# Altium schematic sheet Sheet1.SchDoc
size B
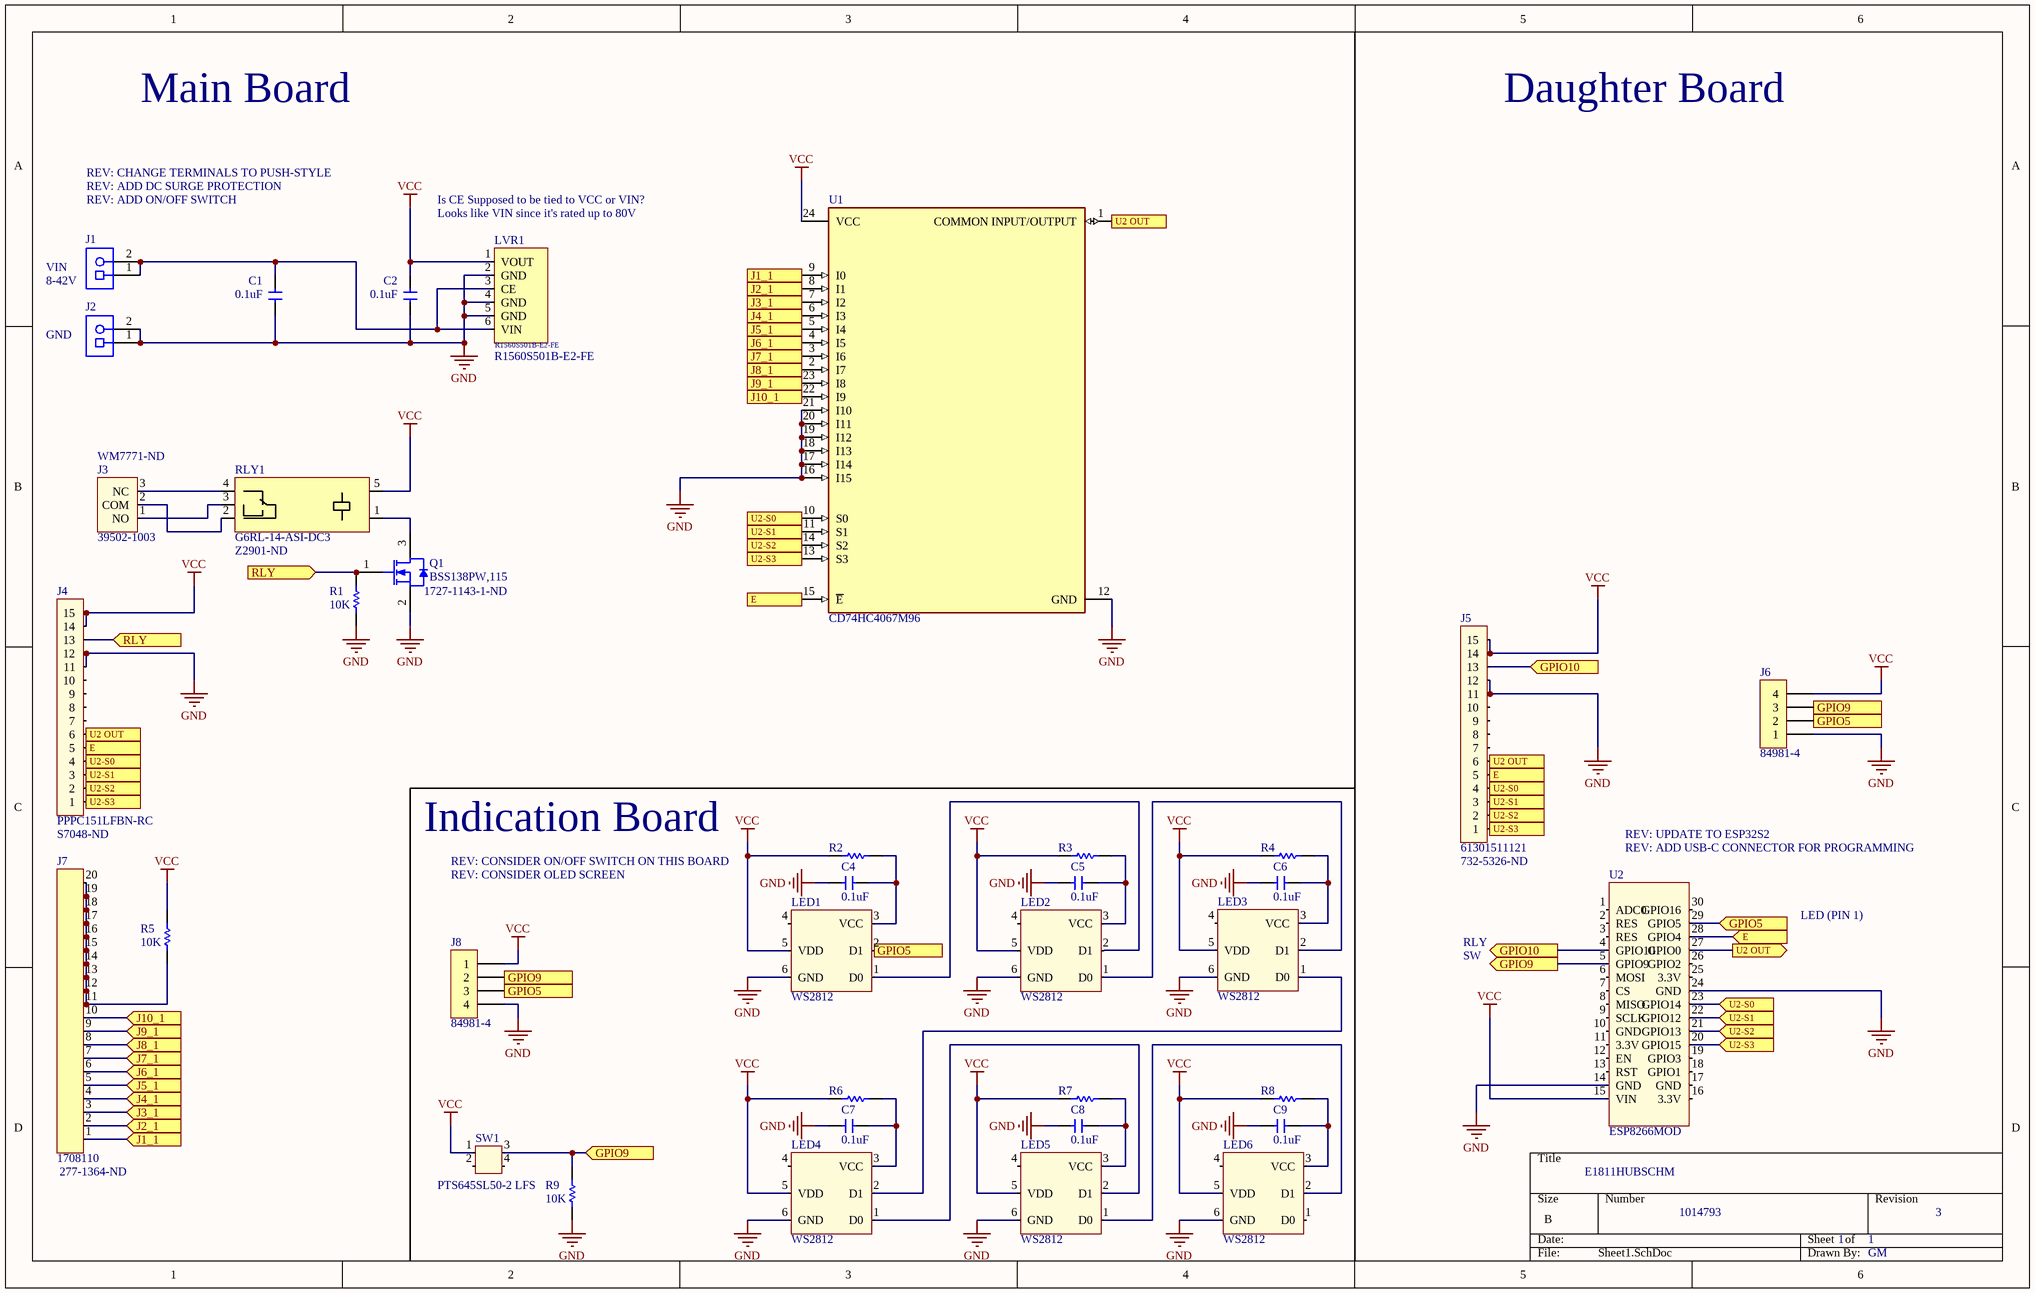
[diagram p0: Sheet1.SchDoc]

## Parts
C1  0.1uF  [CAPC2012N]
C2  0.1uF  [CAPC2012N]
C4  0.1uF  [CAPC2012N]
C5  0.1uF  [CAPC2012N]
C6  0.1uF  [CAPC2012N]
C7  0.1uF  [CAPC2012N]
C8  0.1uF  [CAPC2012N]
C9  0.1uF  [CAPC2012N]
J1  1729128  [PHOE-1729128-2_V]  (value not drawn)
J2  1729128  [PHOE-1729128-2_V]  (value not drawn)
J3  39502-1003  Supplier Part Number 1: WM7771-ND  [39502-1003]
J4  PPPC151LFBN-RC  Supplier Part Number 1: S7048-ND  [PPPC151LFBN-RC]
J5  61301511121  Supplier Part Number 1: 732-5326-ND  [61301511121]
J6  84981-4  [84981-4]
J7  1708110  Supplier Part Number 1: 277-1364-ND  [1708110]
J8  84981-4  [84981-4]
LED1  WS2812  [WS2812]
LED2  WS2812  [WS2812]
LED3  WS2812  [WS2812]
LED4  WS2812  [WS2812]
LED5  WS2812  [WS2812]
LED6  WS2812  [WS2812]
LVR1  R1560S501B-E2-FE  [HSOP-6J]
Q1  BSS138PW,115  Supplier Part Number 1: 1727-1143-1-ND  [NXP-SOT323_M]
R1  10K  [RESC2012N]
R2  150  [RESC2012N]  (value not drawn)
R3  150  [RESC2012N]  (value not drawn)
R4  150  [RESC2012N]  (value not drawn)
R5  10K  [RESC2012N]
R6  150  [RESC2012N]  (value not drawn)
R7  150  [RESC2012N]  (value not drawn)
R8  150  [RESC2012N]  (value not drawn)
R9  10K  [RESC2012N]
RLY1  G6RL-14-ASI-DC3  Supplier Part Number 1: Z2901-ND  [G6RL-14-ASI-DC3]
SW1  PTS645SL50-2 LFS  [PTS645SL50-2 LFS]
U1  CD74HC4067M96  [FP-DW0024A-MFG]
U2  ESP8266MOD  [ESP8266NODEMCU]

## Ports
E (in), GPIO5 (in), GPIO9 (in), GPIO9 (out), GPIO10 (in), GPIO10 (out), J1_1 (in), J2_1 (in), J3_1 (in), J4_1 (in), J5_1 (in), J6_1 (in), J7_1 (in), J8_1 (in), J9_1 (in), J10_1 (in), RLY (in), U2 OUT (out), U2-S0 (in), U2-S1 (in), U2-S2 (in), U2-S3 (in)

## Nets
GND: C1.1 C2.1 C4.1 C5.1 C6.1 C7.1 C8.1 C9.1 J2.1 J2.2 J4.11 J4.12 J5.11 J5.12 J6.1 J8.4 LED1.6(GND) LED2.6(GND) LED3.6(GND) LED4.6(GND) LED5.6(GND) LED6.6(GND) LVR1.2(GND) LVR1.4(GND) LVR1.5(GND) Q1.2(S) R1.1 R9.1 U1.12(GND) U1.16(I15) U1.17(I14) U1.18(I13) U1.19(I12) U1.20(I11) U1.21(I10) U2.14(GND) U2.24(GND)
VCC: C2.2 J4.14 J4.15 J5.14 J5.15 J6.4 J8.1 LED1.5(VDD) LED2.5(VDD) LED3.5(VDD) LED4.5(VDD) LED5.5(VDD) LED6.5(VDD) LVR1.1(VOUT) R2.1 R3.1 R4.1 R5.2 R6.1 R7.1 R8.1 RLY1.5 SW1.1 U1.24(VCC) U2.15(VIN)
E: J4.5 J5.5 U1.15(~{E}) U2.28(GPIO4) ; port E
GPIO5: J6.2 J8.3 LED1.2(D1) U2.29(GPIO5) ; port GPIO5
GPIO9: J6.3 J8.2 R9.2 SW1.3 U2.5(GPIO9) ; port GPIO9
GPIO10: J5.13 U2.4(GPIO10) ; port GPIO10
J1_1: J7.1 U1.9(I0) ; port J1_1
J2_1: J7.2 U1.8(I1) ; port J2_1
J3_1: J7.3 U1.7(I2) ; port J3_1
J4_1: J7.4 U1.6(I3) ; port J4_1
J5_1: J7.5 U1.5(I4) ; port J5_1
J6_1: J7.6 U1.4(I5) ; port J6_1
J7_1: J7.7 U1.3(I6) ; port J7_1
J8_1: J7.8 U1.2(I7) ; port J8_1
J9_1: J7.9 U1.23(I8) ; port J9_1
J10_1: J7.10 U1.22(I9) ; port J10_1
RLY: J4.13 Q1.1(G) R1.2 ; port RLY
U2 OUT: J4.6 J5.6 U1.1(COMMON_INPUT/OUTPUT) U2.27(GPIO0) ; port U2 OUT
U2-S0: J4.4 J5.4 U1.10(S0) U2.23(GPIO14) ; port U2-S0
U2-S1: J4.3 J5.3 U1.11(S1) U2.22(GPIO12) ; port U2-S1
U2-S2: J4.2 J5.2 U1.14(S2) U2.21(GPIO13) ; port U2-S2
U2-S3: J4.1 J5.1 U1.13(S3) U2.20(GPIO15) ; port U2-S3
NetC1_2: C1.2 J1.1 J1.2 LVR1.3(CE) LVR1.6(VIN)
NetC4_2: C4.2 LED1.3(VCC) R2.2
NetC5_2: C5.2 LED2.3(VCC) R3.2
NetC6_2: C6.2 LED3.3(VCC) R4.2
NetC7_2: C7.2 LED4.3(VCC) R6.2
NetC8_2: C8.2 LED5.3(VCC) R7.2
NetC9_2: C9.2 LED6.3(VCC) R8.2
NetJ3_1: J3.1(NO) RLY1.3
NetJ3_2: J3.2(COM) RLY1.2
NetJ3_3: J3.3(NC) RLY1.4
NetJ7_11: J7.11 J7.12 J7.13 J7.14 J7.15 J7.16 J7.17 J7.18 J7.19 J7.20 R5.1
NetLED1_1: LED1.1(D0) LED2.2(D1)
NetLED2_1: LED2.1(D0) LED3.2(D1)
NetLED3_1: LED3.1(D0) LED4.2(D1)
NetLED4_1: LED4.1(D0) LED5.2(D1)
NetLED5_1: LED5.1(D0) LED6.2(D1)
NetQ1_3: Q1.3(D) RLY1.1

Not connected (* = marked no-connect by the designer): J4 7 8 9 10; J5 7 8 9 10; LED1 4(_); LED2 4(_); LED3 4(_); LED4 4(_); LED5 4(_); LED6 1(D0) 4(_); SW1 2 4; U2 1(ADC0) 2(RES) 3(RES) 6(MOSI) 7(CS) 8(MISO) 9(SCLK) 10(GND) 11(3.3V) 12(EN) 13(RST) 16(3.3V) 17(GND) 18(GPIO1) 19(GPIO3) 25(3.3V) 26(GPIO2) 30(GPIO16)

## Notes on the sheet
- Main Board
- Daughter Board
- REV: CHANGE TERMINALS TO PUSH-STYLE
- REV: ADD DC SURGE PROTECTION
- REV: ADD ON/OFF SWITCH
- Is CE Supposed to be tied to VCC or VIN?
- (near LVR1) Looks like VIN since it's rated up to 80V
- VIN
- 8-42V
- GND
- Indication Board
- REV: UPDATE TO ESP32S2
- REV: CONSIDER ON/OFF SWITCH ON THIS BOARD
- REV: CONSIDER OLED SCREEN
- REV: ADD USB-C CONNECTOR FOR PROGRAMMING
- RLY
- SW
- LED (PIN 1)
- E1811HUBSCHM
- 1014793
- 1
- 3
- GM

## Library data of the parts
C1 C2 C4-C9 = Cap_0.1uF_50V_0805: CAP CER 0.1UF 50V; Manufacturer: KEMET; Manufacturer P/N: C0805C104M5RACAUTO; Dielectric Material: Ceramic; Tolerance: 20%; Dielectric: X7R; Capacitance: 100nF; Supplier 1: Digi-Key; Supplier Part Number 1: 399-12977-1-ND; Mount: Surface Mount; Case/Package: 0805; Case Code (Metric): 2012; Case Code (Imperial): 0805; Contact Plating: Matte,Tin; Min Operating Temperature: -55°C; Max Operating Temperature: 125°C; Voltage Rating: 50V; Voltage Rating (DC): 50V; Termination: Wraparound; Length: 2mm; Width: 0.049inch; Thickness: 0.035inch; Depth: 1.25mm; Ratings: AEC-Q200; REACH SVHC: No SVHC
J1 J2 = CMP-2000-05815-1: PCB Terminal Block, 13.5 A, 400 V, 2-Pin THD, RoHS, Bulk; Manufacturer: Phoenix Contact; Package Version: 03/2015; No. of Rows: 1; Pitch: 5.08mm; No. of Positions: 2; Voltage Rating: 400V; Current Rating: 13500mA; Connector Type: Screw; Current: 10A; Voltage: 300V; Max Current Rating: 13.5A; Test Voltage: 4kV; Wire Gauge (Max): 26AWG; Wire Gauge (Min): 14AWG; Approvals: UL,CSA; Manufacturer URL: http://www.phoenixcontact.com/; Datasheet URL: https://datasheet.ciiva.com/16046/1729128-16046181.pdf; RoHS: TRUE; Package URL: https://www.phoenixcontact.com/online/portal/pi/pxc/product_detail_page/!ut/p/b1/3VdJjqNKFDxLH8AFycySyWY2ozFsEPOMMQaDOX1XedGL_1Vdm5YXJleknhSKeBkvI6EA8ncAo3AYoDhBQGco6KN7VURTdemj9us_IEKEZo_YHiPAEWEFmDGOHMORkqKYCORBZxgL7ZoaZYcbFFUZ3fqxSY6GOuxydWUuHqz1ynmMFygu583Bob0Ewr6Sd_l-5m-kAueHiB0jpRwZwe58wwtkpxtMYd_LmGcDRU02dRNEyWt6Y2ti5pSyJ_reIkzIulrqApdnbT11V5jnCKbYNCvhEM1MCpPByat_X379-iThf08CI5GfOPqfBeS3BRoBOdD55AKVv0iLwCMq-2BrzXWSGRH7pUGD9uwXQjiph3xL0DKQwdGa0JImiIOmBNOestqgwTHSSs2oOep-78apyXQBvNi8ZLaFjvjWvcaUEBu0MC6Wbe-d6mB0FAebo2lUWinqYaZs5DAYzV0RP9yitUjnGJ0iI9xhZkT42OCQNUJJhkgWINNQLP2JFP6OpMg3JCVg70jqHT0lvKOnhHf0lPuOnnLf0VPuWx6_dxwUIvwk5WMkT0kLL1mh61l2yZVSzG3pYV_bqo-mj6uMKwKwdnnW8Jh5RTOJzMOA5c-eJDaZQw4mTMPH02PvS_ZAqNVjVTo2WyYLkwH_KU1mmmG5kjRhDqPXLwwVHvVOjCM60-fpXvTDfMGW1PVFVS1r4e4yVDk4ZdNbkUHvqPqQSeian4UD39fNKmachqdJ1NJbyk8rXT9mXTvPk3oE5meulKGgiruPJek-4I9hTT6G8ZLOyRSm2RRVbThERQad5OS28hdt4YW4vG0stgYYzsWsK4_7y6DZMjJSCqri1kyiZR5vD7pwIrNR7QwPHTcLTI5qT7eRlpHrdGiupYlqQDJ7zy_CND8fWWBoLRXxk1RVcXiBQwbTD4Xi7KL-FuO94t9xaqweXzH; PartNumber: 1729128; Package Description: 2-Pin Through Hole Device, Body 8.1 x 10.16 mm, Pitch 5.08 mm; Datasheet Version: 12/2013; Mounting Technology: ThroughHole; Orientation: Horizontal; Package Reference: 1729128-2; Packing: Bulk; Supplier 1: Digi-Key; Manufacturer Part Number: 1729128; Category: Terminal Blocks; Stock 1: 30124; Pricing 1: 1=1.09000, 10=1.04700, 50=1.00100, 100=0.97370, 250=0.91000, 500=0.83720, 1000=0.77350, 2500=0.73710, 5000=0.69160 (USD); Mount: Through Hole; Number of Pins: 2; Color: Green; Housing Color: Green; Housing Material: Polyamide; Contact Material: Tin; Weight: 0.069842oz; Insulation Material: Nylon; Min Operating Temperature: -20°C; Max Operating Temperature: 100°C; Packaging: Bulk; Termination: Solder; Number of Positions: 2; Number of Poles: 2; Package Quantity: 50; Number of Contacts: 2; Series: MKDSN; Number of Rows: 1; Number of Levels: 1; Number of Positions Per Level: 2; Max Supply Voltage: 400V; Number of Circuits: 2; Length: 8.1mm; Width: 13.5mm; Height: 13.5mm; Depth: 8.1mm; Wire/Cable Gauge: 26AWG; Radiation Hardening: No; REACH SVHC: No SVHC; Flammability Rating: UL94 V-0; RoHS Compliant: Yes; Lead Free: Lead Free; ComponentLink1URL: https://datasheet.ciiva.com/823/1729128-823779.pdf?src-supplier=Digi-Key; ComponentLink1Description: https://datasheet.ciiva.com/823/1729128-823779.pdf?src-supplier=Digi-Key; ComponentLink2URL: https://datasheet.ciiva.com/15169/getdatasheetpartid-199310-15169845.pdf?src-supplier=Verical; ComponentLink2Description: https://datasheet.ciiva.com/15169/getdatasheetpartid-199310-15169845.pdf?src-supplier=Verical; ComponentLink3URL: https://datasheet.ciiva.com/16046/1729128-16046181.pdf?src-supplier=Onlinecomponents.com; ComponentLink3Description: https://datasheet.ciiva.com/16046/1729128-16046181.pdf?src-supplier=Onlinecomponents.com; ComponentLink4URL: https://datasheet.ciiva.com/14607/70054405-14607157.pdf?src-supplier=Allied+Electronics; ComponentLink4Description: https://datasheet.ciiva.com/14607/70054405-14607157.pdf?src-supplier=Allied+Electronics; ComponentLink5URL: https://datasheet.ciiva.com/29218/743664-da-01-en-printklemmenblock-mkdsn-1-5-2-5-08-29218154.pdf?src-supplier=Conrad; ComponentLink5Description: https://datasheet.ciiva.com/29218/743664-da-01-en-printklemmenblock-mkdsn-1-5-2-5-08-29218154.pdf?src-supplier=Conrad
  J2: Supplier Part Number 1: 277-1247-ND
J3 = 39502-1003: TERM BLOCK HDR 3POS 90DEG 3.5MM; Manufacturer: Molex; Manufacturer Part Number: 0395021003; Contact Resistance: 8mR; Current Rating: 8A; Voltage Rating: 300V; Number of Positions: 3; Number of Levels: 1; Supplier 1: Digi-Key; RoHS: Yes; Category: Headers and Wire Housings; Stock 1: 1366; Pricing 1: 1=0.78000, 10=0.64800, 100=0.54000, 1000=0.43200, 5000=0.37800, 10000=0.35910 (USD); Mount: Through Hole; Contact Plating: Tin; Color: Black; Housing Color: Black; Contact Material: Brass; Housing Material: Polyamide; Min Operating Temperature: -40°C; Max Operating Temperature: 105°C; Number of Rows: 1; Package Quantity: 1280; Packaging: Bulk; Termination: Solder; Number of Contacts: 3; Orientation: Right Angle; Number of Circuits: 3; Series: Eurostyle™ ESE 39502; Number of Positions Per Level: 3; Current: 8A; Voltage: 300V; Length: 11.89mm; Width: 9.2mm; Pitch: 3.5mm; Depth: 9.2mm; REACH SVHC: No SVHC; Halogen Free: Low Halogen; ELV: Compliant; Lead Free: Lead Free; Flammability Rating: UL94 V-0; RoHS Compliant: Yes; ComponentLink1URL: http://www.onlinecomponents.com/datasheet/395021003.aspx?p=17943918&src-supplier=Onlinecomponents.com; ComponentLink1Description: http://www.onlinecomponents.com/datasheet/395021003.aspx?p=17943918&src-supplier=Onlinecomponents.com; ComponentLink2URL: http://components.arrow.com/part/dataview/0323_01936340?src-supplier=Arrow+Europe; ComponentLink2Description: http://components.arrow.com/part/dataview/0323_01936340?src-supplier=Arrow+Europe; ComponentLink3URL: http://www.molex.com/webdocs/datasheets/pdf/en-us/0395021003_TERMINAL_BLOCKS.pdf?src-supplier=Avnet; ComponentLink3Description: http://www.molex.com/webdocs/datasheets/pdf/en-us/0395021003_TERMINAL_BLOCKS.pdf?src-supplier=Avnet; ComponentLink4URL: https://www.molex.com/pdm_docs/sd/395021002_sd.pdf?src-supplier=Digi-Key; ComponentLink4Description: https://www.molex.com/pdm_docs/sd/395021002_sd.pdf?src-supplier=Digi-Key; ComponentLink5URL: http://components.arrow.com/part/dataview/44158187S8420486N3303?src-supplier=Arrow+Electronics; ComponentLink5Description: http://components.arrow.com/part/dataview/44158187S8420486N3303?src-supplier=Arrow+Electronics
J4 = PPPC151LFBN-RC: CONN HEADER FMALE 15POS .1" GOLD; Manufacturer: Sullins; Number of Positions: 15; Pitch: 0.1inch; Supplier 1: Digi-Key; Manufacturer Part Number: PPPC151LFBN-RC; RoHS: Yes; Category: Connectors; Stock 1: 4250; Pricing 1: 1=1.02000, 10=0.89300, 100=0.77020, 500=0.63018, 1000=0.56016, 5000=0.50570 (USD); Mount: Through Hole; Color: Black; Contact Plating: Gold; Contact Material: Bronze; Housing Material: Plastic; Package Quantity: 1000; Number of Rows: 1; Packaging: Bulk; Termination: Solder; Connector Type: Header; Contact Type: Female Socket; Length: 38.6mm; Width: 2.5mm; Height: 8.5mm; Lead Free: Lead Free; RoHS Compliant: Yes; ComponentLink1URL: https://media.digikey.com/pdf/Data%20Sheets/Sullins%20PDFs/Female_Headers.100_DS.pdf?src-supplier=Digi-Key; ComponentLink1Description: https://media.digikey.com/pdf/Data%20Sheets/Sullins%20PDFs/Female_Headers.100_DS.pdf?src-supplier=Digi-Key
J5 = 61301511121: WURTH ELEKTRONIK         61301511121            Board-To-Board Connector, Vertical, WR-PHD Series, Through Hole, Header, 15 Contacts, 2.54 mm; Manufacturer: Wurth Electronics; Number of Positions: 15; Gender: Male; Connector Type: Male Pin; Pitch: 0.1inch; Supplier 1: Digi-Key; Manufacturer Part Number: 61301511121; RoHS: Yes; Category: Connectors; Stock 1: 961; Pricing 1: 1=0.82000, 10=0.69700, 25=0.58120, 50=0.48400, 100=0.44000, 500=0.40000 (USD); Mount: Through Hole; Contact Plating: Gold; Contact Material: Copper; Color: Black; Number of Rows: 1; Packaging: Bulk; Termination: Solder; Number of Contacts: 15; Contact Mating Length: 0.236inch; REACH SVHC: Unknown; RoHS Compliant: Yes; ComponentLink1URL: http://www.farnell.com/cad/1737268.pdf?src-supplier=Element14; ComponentLink1Description: http://www.farnell.com/cad/1737268.pdf?src-supplier=Element14; ComponentLink2URL: https://katalog.we-online.de/em/datasheet/6130xx11121.pdf?src-supplier=Digi-Key; ComponentLink2Description: https://katalog.we-online.de/em/datasheet/6130xx11121.pdf?src-supplier=Digi-Key
J7 = 1708110: CONN TERM BLOCK 3.81MM 10POS; Manufacturer: Phoenix Contact; Current Rating: 8A; Voltage Rating: 200V; Number of Positions: 10; Number of Contacts: 20; Connector Type: Screw; Max Current Rating: 10A; Number of Levels: 2; Voltage: 300V; Gender: Male; Wire Gauge (Max): 30AWG; Wire Gauge (Min): 26AWG; Stripping Length: 5mm; Approvals: UL,CSA,cULus,CB,EAC; Supplier 1: Digi-Key; Manufacturer Part Number: 1708110; RoHS: Yes; Category: Terminal Blocks; Stock 1: 37; Pricing 1: 1=18.84000, 10=18.32900, 50=17.13000, 100=15.75970, 250=14.56056, 500=13.87542, 1000=13.01891 (USD); Mount: Through Hole; Number of Pins: 20; Housing Material: Nylon; Contact Material: Tin; Insulation Material: Nylon; Color: Green; Weight: 3lb; Material: Polyamide; Housing Color: Green; Packaging: Bulk; Package Quantity: 50; Termination: Screw; Orientation: Straight; Series: COMBICON MKKDS; Number of Poles: 10; Number of Positions Per Level: 10; Current: 10A; Number of Rows: 2; Number of Circuits: 20; Length: 38.1mm; Width: 16.3mm; Height: 16.2mm; Pitch: 3.81mm; Depth: 16.2mm; Flammability Rating: UL94 V-0; RoHS Compliant: Yes; Lead Free: Lead Free; ComponentLink1URL: https://datasheet.ciiva.com/16071/1708110-16071989.pdf?src-supplier=Onlinecomponents.com; ComponentLink1Description: https://datasheet.ciiva.com/16071/1708110-16071989.pdf?src-supplier=Onlinecomponents.com; ComponentLink2URL: https://datasheet.ciiva.com/824/1708110-824363.pdf?src-supplier=Digi-Key; ComponentLink2Description: https://datasheet.ciiva.com/824/1708110-824363.pdf?src-supplier=Digi-Key; ComponentLink3URL: https://datasheet.ciiva.com/14609/70054443-14609623.pdf?src-supplier=Allied+Electronics; ComponentLink3Description: https://datasheet.ciiva.com/14609/70054443-14609623.pdf?src-supplier=Allied+Electronics
Q1 = CMP-1259-00109-1: N-Channel Trench MOSFET, 60 V, 0.32 A, -55 to 150 degC, 3-Pin SOT323, Tape and Reel; Manufacturer: NXP Semiconductors; Manufacturer Part Number: BSS138PW,115""; IDM [max] (A): 1.2; ID [max] (A): 0.32; Automotive Qualified: Y; Channel Type: N; VDS [max] (V): 60; Packing: Tape & Reel; Rise Time: 3ns; Continuous Drain Current (ID): 320mA; Turn-On Delay Time: 2ns; Turn-Off Delay Time: 9ns; Fall Time: 4ns; Gate to Source Voltage (Vgs): 20V; Rds On Max: 1.6R; Input Capacitance: 50pF; Max Dual Supply Voltage: 60V; Power Dissipation: 260mW; Number of Elements: 1; DatasheetVersion: Rev. 1; PartNumber: BSS138PW,115; ComponentLink2URL: http://www.nxp.com/documents/data_sheet/BSS138PW.pdf; ComponentLink3Description: Package Specification; PackageReference: SOT323; PackageDescription: 3-Pin Small Outline Transistor Package, Body 2 x 1.25 mm, Pitch 0.65 mm; Code_JEITA: SC-70; ComponentLink3URL: http://www.nxp.com/documents/outline_drawing/sot323_po.pdf; ComponentLink1URL: http://www.nxp.com/; ComponentLink2Description: Datasheet; PackageVersion: 06-03-16, 03/2006; Mounting Technology: Surface Mount; ComponentLink1Description: Manufacturer URL; VGSth [typ] (V): 1.2; Supplier 1: Digi-Key; RoHS: Yes; Category: MOSFETs; Stock 1: 503503; Pricing 1: 1=0.210000, 10=0.146000, 100=0.071100, 500=0.059280, 1000=0.041180 (USD); Case/Package: SOT; Number of Pins: 3; Contact Plating: Tin; Min Operating Temperature: -55°C; Max Operating Temperature: 150°C; Package Quantity: 3000; Packaging: Tape and Reel; Drain to Source Voltage (Vdss): 60V; Drain to Source Breakdown Voltage: 60V; Drain to Source Resistance: 1.6R; Max Power Dissipation: 260mW; Radiation Hardening: No; Lead Free: Lead Free; ComponentLink4URL: https://datasheet.ciiva.com/6371/bss138pw-6371075.pdf?src-supplier=Digi-Key; ComponentLink4Description: https://datasheet.ciiva.com/6371/bss138pw-6371075.pdf?src-supplier=Digi-Key; ComponentLink5URL: https://datasheet.ciiva.com/18567/bss138pw-18567014.pdf?src-supplier=Digi-Key; ComponentLink5Description: https://datasheet.ciiva.com/18567/bss138pw-18567014.pdf?src-supplier=Digi-Key; ComponentLink6URL: https://datasheet.ciiva.com/18567/bss138pw-18567015.pdf?src-supplier=Digi-Key; ComponentLink6Description: https://datasheet.ciiva.com/18567/bss138pw-18567015.pdf?src-supplier=Digi-Key; ComponentLink7URL: https://datasheet.ciiva.com/18567/bss138pw-18567016.pdf?src-supplier=Digi-Key; ComponentLink7Description: https://datasheet.ciiva.com/18567/bss138pw-18567016.pdf?src-supplier=Digi-Key; ComponentLink8URL: https://datasheet.ciiva.com/1255/bss138pw-1255034.pdf?src-supplier=Newark; ComponentLink8Description: https://datasheet.ciiva.com/1255/bss138pw-1255034.pdf?src-supplier=Newark
R1 R5 R9 = Res_10K_0805: RES 10K OHM 1/8W 1% 0805; Manufacturer: Vishay; Manufacturer P/N: CRCW080510K0FKEA; Resistance: 10kR; Power Rating: 125mW; Voltage Rating: 150V; Temperature Coefficient: 100ppm/°C; Supplier 1: Digi-Key; Supplier Part Number 1: 541-10.0KCCT-ND; Case/Package: 0805; Weight: 0.000194oz; Case Code (Imperial): 0805; Case Code (Metric): 2012; Contact Plating: Tin; Min Operating Temperature: -55°C; Max Operating Temperature: 155°C; Tolerance: 1%; Package Quantity: 5000; Composition: Thick Film; Military Standard: Not; Termination: SMD/SMT; Voltage Rating (DC): 150V; Length: 2mm; Height: 0.45mm; Width: 1.25mm; Depth: 1.25mm; Radiation Hardening: No; REACH SVHC: Unknown; Lead Free: Lead Free; ComponentLink4URL: http://www.vishay.com/docs/20035/dcrcwe3.pdf; ComponentLink4Description: http://www.vishay.com/docs/20035/dcrcwe3.pdf
R2-R4 R6-R8 = Res_150_0805: RES 150 OHM 1/8W 1% 0805; Manufacturer: Vishay; Manufacturer P/N: CRCW0805150RFKEA; Power Rating: 125mW; Resistance: 150R; Voltage Rating: 150V; Temperature Coefficient: 100ppm/°C; Supplier 1: Digi-Key; Supplier Part Number 1: 541-150CCT-ND; Mount: Surface Mount; Case/Package: 0805; Weight: 0.000194oz; Case Code (Metric): 2012; Case Code (Imperial): 0805; Contact Plating: Tin; Min Operating Temperature: -55°C; Max Operating Temperature: 155°C; Tolerance: 1%; Package Quantity: 10; Composition: Thick Film; Termination: SMD/SMT; Max Power Dissipation: 125mW; Voltage Rating (DC): 150V; Features: Automotive AEC-Q200; Military Standard: Not; Length: 2mm; Height: 0.45mm; Width: 0.049inch; Depth: 1.25mm; Radiation Hardening: No; Lead Free: Lead Free; REACH SVHC: Unknown; ComponentLink3URL: http://www.vishay.com/docs/20035/dcrcwe3.pdf; ComponentLink3Description: http://www.vishay.com/docs/20035/dcrcwe3.pdf
RLY1 = G6RL-14-ASI-DC3: RELAY GENERAL PURPOSE SPDT 8A 3V; Manufacturer: Omron; Coil Current: 73.3mA; Max Voltage Rating (DC): 300V; Operate Time: 10ms; Release Time: 5ms; Max Voltage Rating (AC): 400V; Coil Power: 220mW; Coil Resistance: 40R; Coil Type: Non-Latching; Supplier 1: Digi-Key; Manufacturer Part Number: G6RL-14-ASI-DC3; RoHS: Yes; Category: Power Relays; Stock 1: 2855; Pricing 1: 1=3.90000, 10=3.65200, 25=3.24600, 50=3.08380, 100=2.92140, 250=2.59680, 500=2.43450, 1000=2.27220, 5000=2.19105 (USD); Mount: Through Hole; Number of Pins: 5; Contact Material: Tin,Silver; Weight: 7.8g; Min Operating Temperature: -40°C; Max Operating Temperature: 85°C; Package Quantity: 100; Packaging: Bulk; Throw Configuration: SPDT; Contact Current Rating: 8A; Termination: PC Pin; Relay Type: General Purpose; Coil Voltage (DC): 3V; Radiation Hardening: No; ComponentLink1URL: https://datasheet.ciiva.com/8687/g6rl-0911-8687382.pdf?src-supplier=Avnet; ComponentLink1Description: https://datasheet.ciiva.com/8687/g6rl-0911-8687382.pdf?src-supplier=Avnet; ComponentLink2URL: https://datasheet.ciiva.com/2407/g6rl-0911-2407665.pdf?src-supplier=Digi-Key; ComponentLink2Description: https://datasheet.ciiva.com/2407/g6rl-0911-2407665.pdf?src-supplier=Digi-Key
U1 = CMP-04901-000007-1: IC MUX/DEMUX 1X16 24SOIC; Manufacturer: Texas Instruments; Standoff Height: 0.1mm; Logic Function Desc: Non-Inverting; Max Supply Voltage: 6V; Number Of Inputs: 16; Quiescent Current: 8uA; Number Of Circuits: 1; Propagation Delay: 6ns; Max Junction Temp: +150°C; Min Supply Voltage: 2V; ComponentLink2Description: Datasheet; Octopart: https://octopart.com/cd74hc4067m96-texas+instruments-722802; Ambient Temperature Range High: +125°C; Ipc Land Pattern Name: SOIC127P1030X265-24; Height: 2.65mm; Mouser Description: Multiplexer Switch ICs Hi-Spd CMOS 16Ch Anl Mltplxr/Demltplxr; Temperature Range Low: -55°C; Package: DW0024A; Temperature Range High: +125°C; Lead Free: Yes; ComponentLink2URL: http://www.ti.com/lit/ds/symlink/cd74hc4067.pdf; Manufacturer Part Number: CD74HC4067M96; RoHS: TRUE; Automotive: No; Device Class L1: Integrated Circuits (ICs); Digikey Description: IC MUX/DEMUX 1X16 24SOIC; Device Class L2: Logic ICs; Temperature: -55°C to +125°C; Device Class L3: Multiplexers; Category: IC; Ambient Temperature Range Low: -55°C; Number Of Outputs: 1
J6 J8 = 84981-4
  J8: Supplier 1: Digi-Key; Supplier Part Number 1: A101369CT-ND